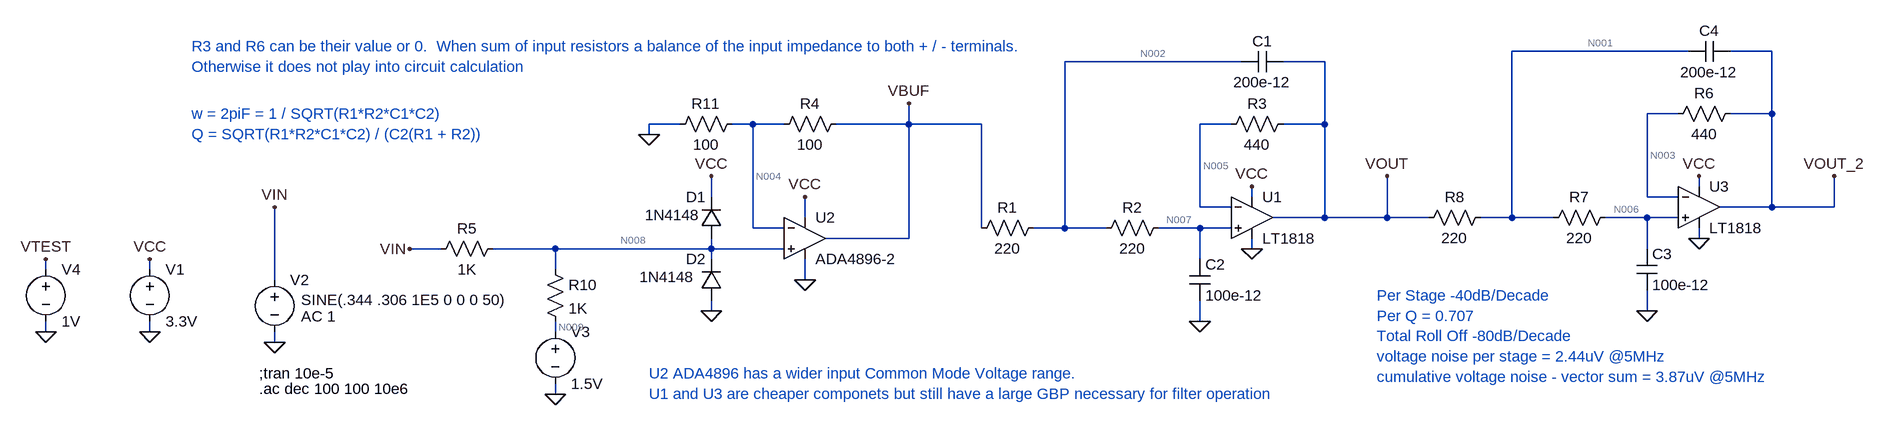
[diagram p0: schematic Sallen & Key LPF.asc]
Sallen & Key LPF.asc, the LTspice schematic file:
Version 4
SHEET 1 1752 680
WIRE 1168 -64 896 -64
WIRE 1296 -64 1232 -64
WIRE 480 -48 208 -48
WIRE 608 -48 544 -48
WIRE 1152 32 1104 32
WIRE 1296 32 1296 -64
WIRE 1296 32 1232 32
WIRE -384 48 -432 48
WIRE -272 48 -304 48
WIRE -224 48 -272 48
WIRE -32 48 -32 16
WIRE -32 48 -144 48
WIRE 80 48 -32 48
WIRE 464 48 416 48
WIRE 608 48 608 -48
WIRE 608 48 544 48
WIRE -432 64 -432 48
WIRE 1184 144 1184 128
WIRE -336 160 -336 128
WIRE 496 160 496 144
WIRE 1104 160 1104 32
WIRE 1152 160 1104 160
WIRE 416 176 416 48
WIRE 464 176 416 176
WIRE 1296 176 1296 32
WIRE 1296 176 1216 176
WIRE 1392 176 1392 128
WIRE 1392 176 1296 176
WIRE -192 192 -192 160
WIRE 608 192 608 48
WIRE 608 192 528 192
WIRE 704 192 704 128
WIRE 704 192 608 192
WIRE 768 192 704 192
WIRE 896 192 896 -64
WIRE 896 192 848 192
WIRE 960 192 896 192
WIRE 1104 192 1040 192
WIRE 1152 192 1104 192
WIRE -272 208 -272 48
WIRE -224 208 -272 208
WIRE 80 208 80 48
WIRE 208 208 208 -48
WIRE 208 208 160 208
WIRE 272 208 208 208
WIRE 416 208 352 208
WIRE 464 208 416 208
WIRE -32 224 -32 48
WIRE -32 224 -160 224
WIRE 1184 224 1184 208
WIRE -752 240 -800 240
WIRE -576 240 -672 240
WIRE -336 240 -336 224
WIRE -336 240 -576 240
WIRE -224 240 -336 240
WIRE 496 240 496 224
WIRE 1104 240 1104 192
WIRE -336 256 -336 240
WIRE 416 256 416 208
WIRE -1360 272 -1360 256
WIRE -1200 272 -1200 256
WIRE -576 272 -576 240
WIRE -1008 288 -1008 176
WIRE -192 288 -192 256
WIRE -336 336 -336 320
WIRE 1104 336 1104 304
WIRE 416 352 416 320
WIRE -1360 368 -1360 352
WIRE -1200 368 -1200 352
WIRE -576 368 -576 352
WIRE -1008 384 -1008 368
WIRE -576 464 -576 448
FLAG -1200 368 0
FLAG -1200 256 VCC
FLAG -1008 384 0
FLAG 416 352 0
FLAG 496 144 VCC
FLAG -1008 176 VIN
FLAG 496 240 0
FLAG -192 288 0
FLAG -192 160 VCC
FLAG -32 16 VBUF
FLAG -336 128 VCC
FLAG -336 336 0
FLAG 704 128 VOUT
FLAG 1104 336 0
FLAG 1184 128 VCC
FLAG 1184 224 0
FLAG 1392 128 VOUT_2
FLAG -576 464 0
FLAG -432 64 0
FLAG -1360 368 0
FLAG -1360 256 VTEST
FLAG -800 240 VIN
SYMBOL voltage -1200 256 R0
WINDOW 123 0 0 Left 0
WINDOW 39 0 0 Left 0
SYMATTR InstName V1
SYMATTR Value 3.3V
SYMBOL voltage -1008 272 R0
WINDOW 123 41 72 Left 2
WINDOW 39 0 0 Left 0
WINDOW 3 41 47 Left 2
SYMATTR Value2 AC 1
SYMATTR Value SINE(.344 .306 1E5 0 0 0 50)
SYMATTR InstName V2
SYMBOL res 560 32 R90
WINDOW 0 0 56 VBottom 2
WINDOW 3 32 56 VTop 2
SYMATTR InstName R3
SYMATTR Value 440
SYMBOL res 368 192 R90
WINDOW 0 0 56 VBottom 2
WINDOW 3 32 56 VTop 2
SYMATTR InstName R2
SYMATTR Value 220
SYMBOL res 176 192 R90
WINDOW 0 0 56 VBottom 2
WINDOW 3 32 56 VTop 2
SYMATTR InstName R1
SYMATTR Value 220
SYMBOL cap 400 256 R0
SYMATTR InstName C2
SYMATTR Value 100e-12
SYMBOL cap 544 -64 R90
WINDOW 0 0 32 VBottom 2
WINDOW 3 32 32 VTop 2
SYMATTR InstName C1
SYMATTR Value 200e-12
SYMBOL res -128 32 R90
WINDOW 0 0 56 VBottom 2
WINDOW 3 32 56 VTop 2
SYMATTR InstName R4
SYMATTR Value 100
SYMBOL res -656 224 R90
WINDOW 0 0 56 VBottom 2
WINDOW 3 32 56 VTop 2
SYMATTR InstName R5
SYMATTR Value 1K
SYMBOL diode -320 224 R180
WINDOW 0 24 64 Left 2
WINDOW 3 33 36 Left 2
SYMATTR InstName D1
SYMATTR Value 1N4148
SYMBOL diode -320 320 R180
WINDOW 0 24 64 Left 2
WINDOW 3 42 37 Left 2
SYMATTR InstName D2
SYMATTR Value 1N4148
SYMBOL res 1248 16 R90
WINDOW 0 0 56 VBottom 2
WINDOW 3 32 56 VTop 2
SYMATTR InstName R6
SYMATTR Value 440
SYMBOL res 1056 176 R90
WINDOW 0 0 56 VBottom 2
WINDOW 3 32 56 VTop 2
SYMATTR InstName R7
SYMATTR Value 220
SYMBOL res 864 176 R90
WINDOW 0 0 56 VBottom 2
WINDOW 3 32 56 VTop 2
SYMATTR InstName R8
SYMATTR Value 220
SYMBOL cap 1088 240 R0
SYMATTR InstName C3
SYMATTR Value 100e-12
SYMBOL cap 1232 -80 R90
WINDOW 0 0 32 VBottom 2
WINDOW 3 32 32 VTop 2
SYMATTR InstName C4
SYMATTR Value 200e-12
SYMBOL res -592 256 R0
SYMATTR InstName R10
SYMATTR Value 1K
SYMBOL voltage -576 352 R0
WINDOW 123 0 0 Left 0
WINDOW 39 0 0 Left 0
SYMATTR InstName V3
SYMATTR Value 1.5V
SYMBOL res -288 32 R90
WINDOW 0 0 56 VBottom 2
WINDOW 3 32 56 VTop 2
SYMATTR InstName R11
SYMATTR Value 100
SYMBOL voltage -1360 256 R0
WINDOW 123 0 0 Left 0
WINDOW 39 0 0 Left 0
SYMATTR InstName V4
SYMATTR Value 1V
SYMBOL OpAmps\\ADA4896-2 -192 160 R0
SYMATTR InstName U2
SYMBOL OpAmps\\LT1818 496 192 R0
SYMATTR InstName U1
SYMBOL OpAmps\\LT1818 1184 176 R0
SYMATTR InstName U3
TEXT -1032 432 Left 2 !;tran 10e-5
TEXT -1032 456 Left 2 !.ac dec 100 100 10e6
TEXT -1136 -72 Left 2 ;R3 and R6 can be their value or 0.  When sum of input resistors a balance of the input impedance to both + / - terminals.\nOtherwise it does not play into circuit calculation
TEXT -1136 32 Left 2 ;w = 2piF = 1 / SQRT(R1*R2*C1*C2)\nQ = SQRT(R1*R2*C1*C2) / (C2(R1 + R2))
TEXT 688 312 Left 2 ;Per Stage -40dB/Decade\nPer Q = 0.707\nTotal Roll Off -80dB/Decade\nvoltage noise per stage = 2.44uV @5MHz\ncumulative voltage noise - vector sum = 3.87uV @5MHz
TEXT -432 432 Left 2 ;U2 ADA4896 has a wider input Common Mode Voltage range.  \nU1 and U3 are cheaper componets but still have a large GBP necessary for filter operation

The netlist it stands for:
* Sallen & Key LPF.asc
V1 VCC 0 3.3V
V2 VIN 0 SINE(.344 .306 1E5 0 0 0 50) AC 1
R3 VOUT N005 440
R2 N007 N002 220
R1 N002 VBUF 220
C2 N007 0 100e-12
C1 VOUT N002 200e-12
R4 VBUF N004 100
R5 N008 VIN 1K
D1 N008 VCC 1N4148
D2 0 N008 1N4148
R6 VOUT_2 N003 440
R7 N006 N001 220
R8 N001 VOUT 220
C3 N006 0 100e-12
C4 VOUT_2 N001 200e-12
R10 N008 N009 1K
V3 N009 0 1.5V
R11 N004 0 100
V4 VTEST 0 1V
XU2 N008 N004 VCC 0 VBUF ADA4896-2  ; pins In+ In- V+ V- OUT
XU1 N007 N005 VOUT VCC 0 LT1818  ; pins In+ In- OUT V+ V-
XU3 N006 N003 VOUT_2 VCC 0 LT1818  ; pins In+ In- OUT V+ V-
.model D D
.lib standard.dio
;tran 10e-5
.ac dec 100 100 10e6
* R3 and R6 can be their value or 0.  When sum of input resistors a balance of the input impedance to both + / - terminals.
* Otherwise it does not play into circuit calculation
* w = 2piF = 1 / SQRT(R1*R2*C1*C2)
* Q = SQRT(R1*R2*C1*C2) / (C2(R1 + R2))
* Per Stage -40dB/Decade
* Per Q = 0.707
* Total Roll Off -80dB/Decade
* voltage noise per stage = 2.44uV @5MHz
* cumulative voltage noise - vector sum = 3.87uV @5MHz
* U2 ADA4896 has a wider input Common Mode Voltage range.
* U1 and U3 are cheaper componets but still have a large GBP necessary for filter operation
.lib ADA4896-2.lib
.lib LTC2.lib
.backanno
.end

* Results of the author's LTspice run, read from the files saved beside the schematic
* Operating Point, zero values left out:
*   V(vcc) = 3.3 V
*   V(vin) = 344 mV
*   V(vout) = 1.854 V
*   V(n005) = 1.855 V
*   V(n007) = 1.855 V
*   V(n002) = 1.854 V
*   V(vbuf) = 1.854 V
*   V(n004) = 927.5 mV
*   V(n008) = 927.5 mV
*   V(vout_2) = 1.854 V
*   V(n003) = 1.854 V
*   V(n006) = 1.855 V
*   V(n001) = 1.854 V
*   V(n009) = 1.5 V
*   V(vtest) = 1 V
*   I(D2) = -2.521 nA
*   I(D1) = -2.522 nA
*   I(R11) = 9.275 mA
*   I(R10) = -572.5 µA
*   I(R8) = 1.644 µA
*   I(R7) = 1.644 µA
*   I(R6) = -1.644 µA
*   I(R5) = 583.5 µA
*   I(R4) = 9.264 mA
*   I(R1) = 1.644 µA
*   I(R2) = 1.644 µA
*   I(R3) = -1.644 µA
*   I(V3) = -572.5 µA
*   I(V2) = 583.5 µA
*   I(V1) = -28.9 mA
*   Ix(u2:1) = -11.07 µA
*   Ix(u2:2) = -11.05 µA
*   Ix(u2:3) = 12.26 mA
*   Ix(u2:4) = -12.26 mA
*   Ix(u2:5) = -9.262 mA
*   Ix(u1:1) = -1.644 µA
*   Ix(u1:2) = -1.644 µA
*   Ix(u1:3) = 3.289 µA
*   Ix(u1:4) = 8.319 mA
*   Ix(u1:5) = -8.319 mA
*   Ix(u3:1) = -1.644 µA
*   Ix(u3:2) = -1.644 µA
*   Ix(u3:3) = 1.644 µA
*   Ix(u3:4) = 8.319 mA
*   Ix(u3:5) = -8.318 mA
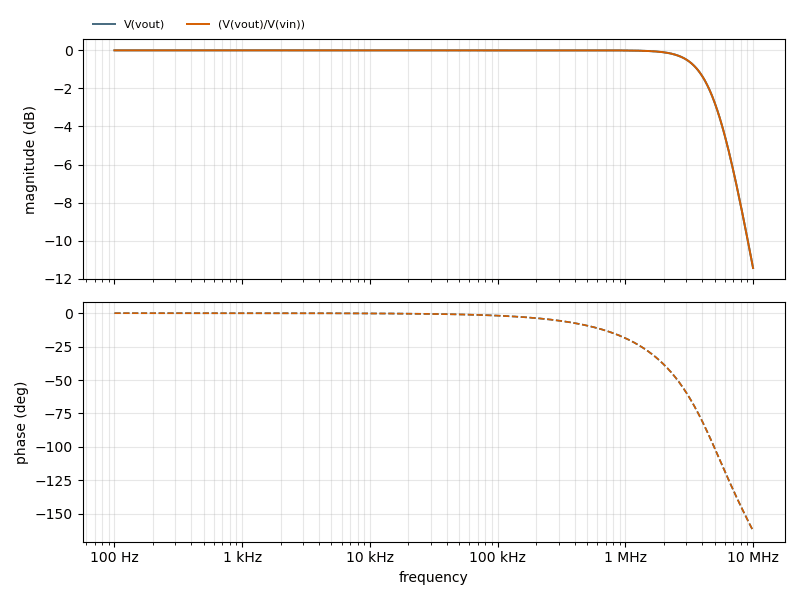
[diagram p1: AC Analysis of Sallen & Key LPF.asc, plotted from the saved traces]
* AC Analysis, 1 run:
*   V(vout): -0.00 dB at 100 Hz, -11.43 dB at 10 MHz, peak -0.00 dB at 102.3 Hz, 3 dB below the peak at 5.164 MHz
*   (V(vout)/V(vin)): -0.00 dB at 100 Hz, -11.43 dB at 10 MHz, peak -0.00 dB at 102.3 Hz, 3 dB below the peak at 5.164 MHz